# EAGLE design 380_v1 (EAGLE 9.0.0)
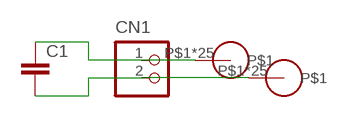
[diagram p0: schematic, sheet 1]

## Parts
C1  C-EUC1608  [C1608]
CN1  B2P-VH  [B2P-VH]
U$1  MOTOR_PIN2  [PAD_PIN]
U$2  MOTOR_PIN2  [PAD_PIN]

## Nets
N$1: C1.1 CN1.1 U$1.P$1 U$1.P$2 U$1.P$3 U$1.P$4 U$1.P$5 U$1.P$6 U$1.P$7 U$1.P$8 U$1.P$9 U$1.P$10 U$1.P$11 U$1.P$12 U$1.P$13 U$1.P$14 U$1.P$15 U$1.P$16 U$1.P$17 U$1.P$18 U$1.P$19 U$1.P$20 U$1.P$21 U$1.P$22 U$1.P$23 U$1.P$24 U$1.P$25
N$2: C1.2 CN1.2 U$2.P$1 U$2.P$2 U$2.P$3 U$2.P$4 U$2.P$5 U$2.P$6 U$2.P$7 U$2.P$8 U$2.P$9 U$2.P$10 U$2.P$11 U$2.P$12 U$2.P$13 U$2.P$14 U$2.P$15 U$2.P$16 U$2.P$17 U$2.P$18 U$2.P$19 U$2.P$20 U$2.P$21 U$2.P$22 U$2.P$23 U$2.P$24 U$2.P$25

## Library data of the parts
C1 = rcl:C-EU: CAPACITOR, European symbol; SPICEPREFIX: C
CN1 = jst-vh:B2P-VH: Wire-to-Board 3.96mm pitch top mount connector Source: http://www.jst-mfg.com/product/pdf/jpn/VH.pdf http://www.jst-mfg.com/product/detail.php?series=262
U$1 U$2 = motor:MOTOR_PIN2

## Board
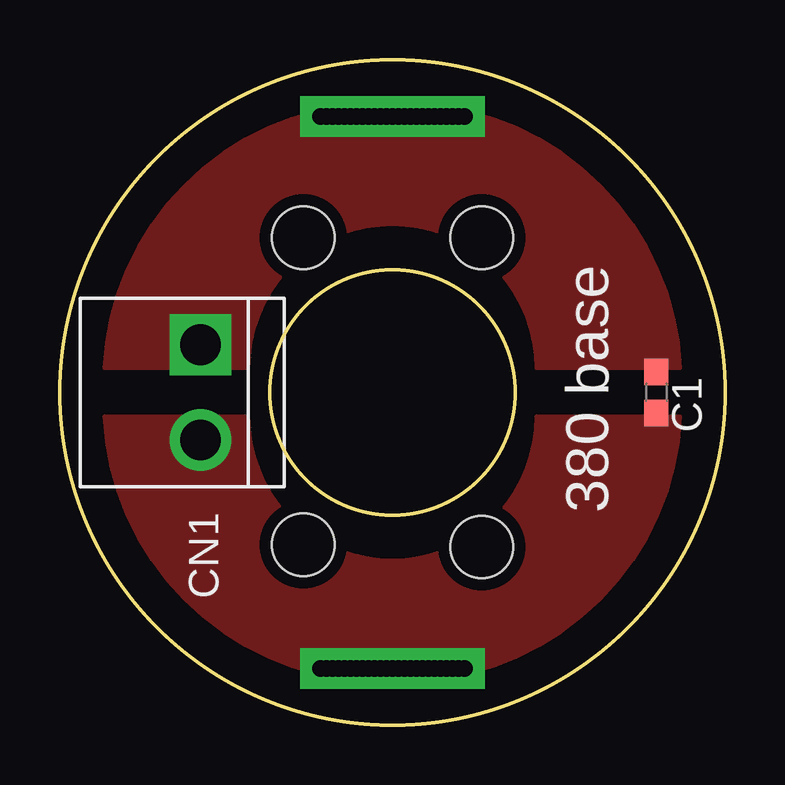
[diagram p1: board, top side]
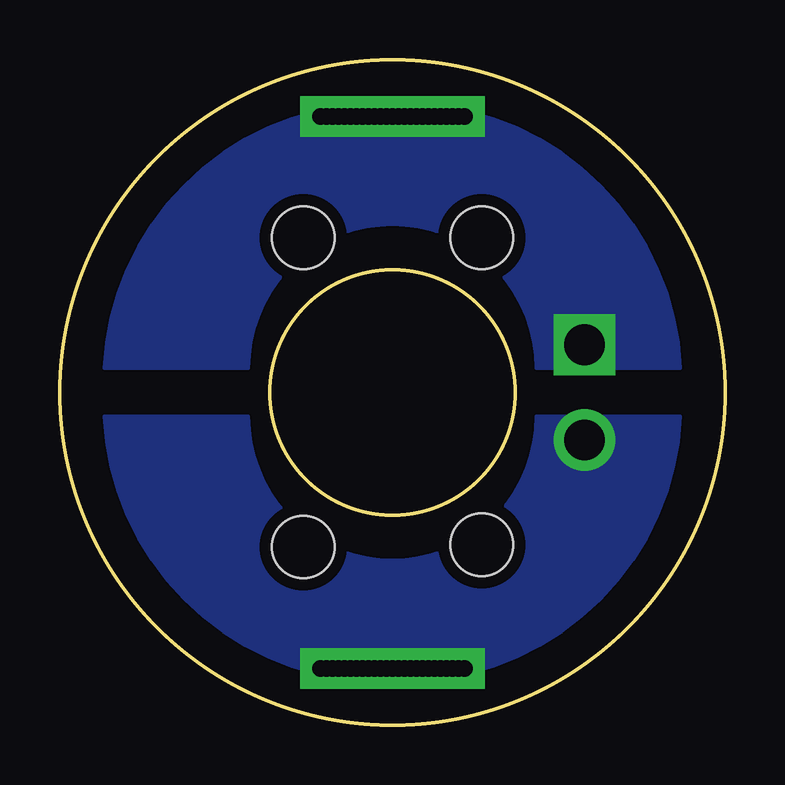
[diagram p2: board, bottom side, seen from below]

Size 27.7 x 27.7 mm. Coordinates in mm from the lower left corner, seen from the top.
Outline: circle at 13.85,13.85 radius 13.85
Outline: circle at 13.85,13.85 radius 5.1
Copper layers (1*16): Top 0.035mm / dielectric 1.6mm / Bottom 0.035mm
Design rules "Elecrow_2-layer_PCB_eagle_rule": minimum track width 6mil, minimum drill 12mil, track to track 6mil, track to pad 6mil, pad to pad 6mil, via to via 8mil, smd to smd 0mil, copper to edge 20mil, drill to drill 10mil, minimum pad ring 6mil, minimum via ring 6mil, stop-mask expansion 0mil, vias tented up to drill 100mil, thermal gap 10mil
Holes 2.6 mm at 17.57,20.3 10.13,20.3 10.13,7.5 17.57,7.4

### Footprints (pad centres in the part's own frame; a part is rotated, then mirrored left to right if it is on the bottom)
C1608 = smd 1.1 x 1: 1 -0.85,0; 2 0.85,0
B2P-VH = drill 1.7 square: 1 -1.98,0 | drill 1.7: 2 1.98,0
PAD_PIN = drill 0.7 pad 1.676 square: P$1 0,0; P$2 -0.25,0; P$3 -0.5,0; P$4 -0.75,0; P$5 -1,0; P$6 -1.25,0; P$7 -1.5,0; P$8 -1.75,0; P$9 -2,0; P$10 -2.25,0; P$11 -2.5,0; P$12 -2.75,0; P$13 -3,0; P$14 0.25,0; P$15 0.5,0; P$16 0.75,0; P$17 1,0; P$18 1.25,0; P$19 1.5,0; P$20 1.75,0; P$21 2,0; P$22 2.25,0; P$23 2.5,0; P$24 2.75,0; P$25 3,0

### Placement (x,y rotation side)
C1  24.85,13.85 270 top
CN1  5.85,13.85 270 top
U$1  13.85,25.35 0 top
U$2  13.85,2.35 0 top

### Tracks (layer width: path | path; a pad name or v marks a point on that pad's centre or on a via)
N$1
  pour Bottom (no thermals): 1.85,14.85 arc-90 13.85,25.85 arc-90 25.85,14.85 19.85,14.85 arc90 13.85,20.85 arc90 7.85,14.85
  pour Top (no thermals): 1.85,14.85 arc-90 13.85,25.85 arc-90 25.85,14.85 19.85,14.85 arc90 13.85,20.85 arc90 7.85,14.85
N$2
  pour Top (no thermals): 25.85,12.85 arc-90 13.85,1.85 arc-90 1.85,12.85 7.85,12.85 arc90 13.85,6.85 arc90 19.85,12.85
  pour Bottom (no thermals): 25.85,12.85 arc-90 13.85,1.85 arc-90 1.85,12.85 7.85,12.85 arc90 13.85,6.85 arc90 19.85,12.85

### Text on the board
tNames: 380 base